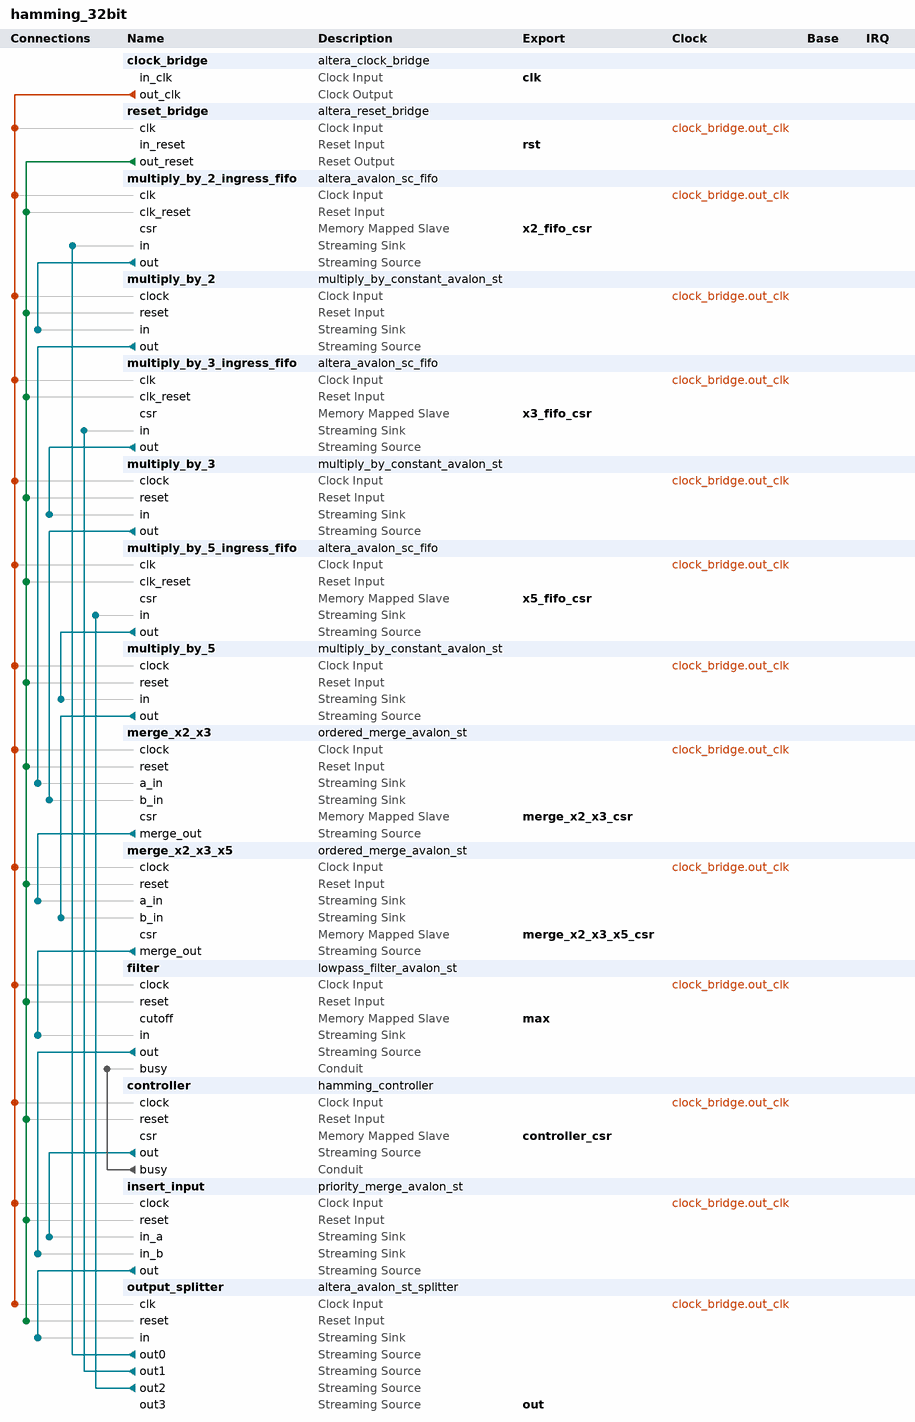
[diagram p0: system contents]
# Platform Designer (Qsys) system hamming_32bit, Cyclone V 5CSXFC6C6U23C8ES
# Parameters at their usual value, and those the tool derives, are not listed.
package require -exact qsys 13.1
create_system hamming_32bit
set_project_property DEVICE_FAMILY {Cyclone V}
set_project_property DEVICE 5CSXFC6C6U23C8ES

add_instance clock_bridge altera_clock_bridge 13.1
set_instance_parameter_value clock_bridge DERIVED_CLOCK_RATE 0
set_instance_parameter_value clock_bridge EXPLICIT_CLOCK_RATE 0

add_instance reset_bridge altera_reset_bridge 13.1
set_instance_parameter_value reset_bridge ACTIVE_LOW_RESET 0
set_instance_parameter_value reset_bridge SYNCHRONOUS_EDGES deassert

add_instance multiply_by_2_ingress_fifo altera_avalon_sc_fifo 13.1
set_instance_parameter_value multiply_by_2_ingress_fifo SYMBOLS_PER_BEAT 4
set_instance_parameter_value multiply_by_2_ingress_fifo BITS_PER_SYMBOL 8
set_instance_parameter_value multiply_by_2_ingress_fifo FIFO_DEPTH 256
set_instance_parameter_value multiply_by_2_ingress_fifo CHANNEL_WIDTH 0
set_instance_parameter_value multiply_by_2_ingress_fifo ERROR_WIDTH 0
set_instance_parameter_value multiply_by_2_ingress_fifo USE_PACKETS 1
set_instance_parameter_value multiply_by_2_ingress_fifo USE_FILL_LEVEL 1
set_instance_parameter_value multiply_by_2_ingress_fifo USE_MEMORY_BLOCKS 1
set_instance_parameter_value multiply_by_2_ingress_fifo USE_STORE_FORWARD 0

add_instance multiply_by_2 multiply_by_constant_avalon_st 1.0
set_instance_parameter_value multiply_by_2 IN_WIDTH 32
set_instance_parameter_value multiply_by_2 OUT_WIDTH 35
set_instance_parameter_value multiply_by_2 MULTIPLIER 2

add_instance multiply_by_3_ingress_fifo altera_avalon_sc_fifo 13.1
set_instance_parameter_value multiply_by_3_ingress_fifo SYMBOLS_PER_BEAT 4
set_instance_parameter_value multiply_by_3_ingress_fifo BITS_PER_SYMBOL 8
set_instance_parameter_value multiply_by_3_ingress_fifo FIFO_DEPTH 256
set_instance_parameter_value multiply_by_3_ingress_fifo CHANNEL_WIDTH 0
set_instance_parameter_value multiply_by_3_ingress_fifo ERROR_WIDTH 0
set_instance_parameter_value multiply_by_3_ingress_fifo USE_PACKETS 1
set_instance_parameter_value multiply_by_3_ingress_fifo USE_FILL_LEVEL 1
set_instance_parameter_value multiply_by_3_ingress_fifo USE_MEMORY_BLOCKS 1
set_instance_parameter_value multiply_by_3_ingress_fifo USE_STORE_FORWARD 0

add_instance multiply_by_3 multiply_by_constant_avalon_st 1.0
set_instance_parameter_value multiply_by_3 IN_WIDTH 32
set_instance_parameter_value multiply_by_3 OUT_WIDTH 35
set_instance_parameter_value multiply_by_3 MULTIPLIER 3

add_instance multiply_by_5_ingress_fifo altera_avalon_sc_fifo 13.1
set_instance_parameter_value multiply_by_5_ingress_fifo SYMBOLS_PER_BEAT 4
set_instance_parameter_value multiply_by_5_ingress_fifo BITS_PER_SYMBOL 8
set_instance_parameter_value multiply_by_5_ingress_fifo FIFO_DEPTH 512
set_instance_parameter_value multiply_by_5_ingress_fifo CHANNEL_WIDTH 0
set_instance_parameter_value multiply_by_5_ingress_fifo ERROR_WIDTH 0
set_instance_parameter_value multiply_by_5_ingress_fifo USE_PACKETS 1
set_instance_parameter_value multiply_by_5_ingress_fifo USE_FILL_LEVEL 1
set_instance_parameter_value multiply_by_5_ingress_fifo USE_MEMORY_BLOCKS 1
set_instance_parameter_value multiply_by_5_ingress_fifo USE_STORE_FORWARD 0

add_instance multiply_by_5 multiply_by_constant_avalon_st 1.0
set_instance_parameter_value multiply_by_5 IN_WIDTH 32
set_instance_parameter_value multiply_by_5 OUT_WIDTH 35
set_instance_parameter_value multiply_by_5 MULTIPLIER 5

add_instance merge_x2_x3 ordered_merge_avalon_st 1.0
set_instance_parameter_value merge_x2_x3 DATA_WIDTH 35
set_instance_parameter_value merge_x2_x3 CSR_WIDTH 32
set_instance_parameter_value merge_x2_x3 SEND_ENDOFPACKET 1
set_instance_parameter_value merge_x2_x3 END_PACKET_VALUE 0

add_instance merge_x2_x3_x5 ordered_merge_avalon_st 1.0
set_instance_parameter_value merge_x2_x3_x5 DATA_WIDTH 35
set_instance_parameter_value merge_x2_x3_x5 CSR_WIDTH 32
set_instance_parameter_value merge_x2_x3_x5 SEND_ENDOFPACKET 1
set_instance_parameter_value merge_x2_x3_x5 END_PACKET_VALUE 0

add_instance filter lowpass_filter_avalon_st 1.0
set_instance_parameter_value filter IN_WIDTH 35
set_instance_parameter_value filter OUT_WIDTH 32
set_instance_parameter_value filter DEFAULT_CUTOFF -1
set_instance_parameter_value filter FORWARD_DELIMITERS 0
set_instance_parameter_value filter EOP_ON_EXCEED 1
set_instance_parameter_value filter NEW_EOP_VALUE 0

add_instance controller hamming_controller 1.0
set_instance_parameter_value controller WIDTH 32

add_instance insert_input priority_merge_avalon_st 1.0
set_instance_parameter_value insert_input WIDTH 32

add_instance output_splitter altera_avalon_st_splitter 13.1
set_instance_parameter_value output_splitter NUMBER_OF_OUTPUTS 4
set_instance_parameter_value output_splitter QUALIFY_VALID_OUT 1
set_instance_parameter_value output_splitter USE_READY 1
set_instance_parameter_value output_splitter USE_VALID 1
set_instance_parameter_value output_splitter USE_PACKETS 1
set_instance_parameter_value output_splitter USE_CHANNEL 0
set_instance_parameter_value output_splitter USE_ERROR 0
set_instance_parameter_value output_splitter USE_DATA 1
set_instance_parameter_value output_splitter DATA_WIDTH 32
set_instance_parameter_value output_splitter CHANNEL_WIDTH 1
set_instance_parameter_value output_splitter ERROR_WIDTH 1
set_instance_parameter_value output_splitter BITS_PER_SYMBOL 8
set_instance_parameter_value output_splitter MAX_CHANNELS 1
set_instance_parameter_value output_splitter READY_LATENCY 0

# connections
add_connection clock_bridge.out_clk controller.clock clock
add_connection clock_bridge.out_clk filter.clock clock
add_connection clock_bridge.out_clk insert_input.clock clock
add_connection clock_bridge.out_clk merge_x2_x3.clock clock
add_connection clock_bridge.out_clk merge_x2_x3_x5.clock clock
add_connection clock_bridge.out_clk multiply_by_2.clock clock
add_connection clock_bridge.out_clk multiply_by_2_ingress_fifo.clk clock
add_connection clock_bridge.out_clk multiply_by_3.clock clock
add_connection clock_bridge.out_clk multiply_by_3_ingress_fifo.clk clock
add_connection clock_bridge.out_clk multiply_by_5.clock clock
add_connection clock_bridge.out_clk multiply_by_5_ingress_fifo.clk clock
add_connection clock_bridge.out_clk output_splitter.clk clock
add_connection clock_bridge.out_clk reset_bridge.clk clock
add_connection reset_bridge.out_reset controller.reset reset
add_connection reset_bridge.out_reset filter.reset reset
add_connection reset_bridge.out_reset insert_input.reset reset
add_connection reset_bridge.out_reset merge_x2_x3.reset reset
add_connection reset_bridge.out_reset merge_x2_x3_x5.reset reset
add_connection reset_bridge.out_reset multiply_by_2.reset reset
add_connection reset_bridge.out_reset multiply_by_2_ingress_fifo.clk_reset reset
add_connection reset_bridge.out_reset multiply_by_3.reset reset
add_connection reset_bridge.out_reset multiply_by_3_ingress_fifo.clk_reset reset
add_connection reset_bridge.out_reset multiply_by_5.reset reset
add_connection reset_bridge.out_reset multiply_by_5_ingress_fifo.clk_reset reset
add_connection reset_bridge.out_reset output_splitter.reset reset
add_connection controller.out insert_input.in_a avalon_streaming
add_connection filter.out insert_input.in_b avalon_streaming
add_connection insert_input.out output_splitter.in avalon_streaming
add_connection merge_x2_x3.merge_out merge_x2_x3_x5.a_in avalon_streaming
add_connection merge_x2_x3_x5.merge_out filter.in avalon_streaming
add_connection multiply_by_2.out merge_x2_x3.a_in avalon_streaming
add_connection multiply_by_2_ingress_fifo.out multiply_by_2.in avalon_streaming
add_connection multiply_by_3.out merge_x2_x3.b_in avalon_streaming
add_connection multiply_by_3_ingress_fifo.out multiply_by_3.in avalon_streaming
add_connection multiply_by_5.out merge_x2_x3_x5.b_in avalon_streaming
add_connection multiply_by_5_ingress_fifo.out multiply_by_5.in avalon_streaming
add_connection output_splitter.out0 multiply_by_2_ingress_fifo.in avalon_streaming
add_connection output_splitter.out1 multiply_by_3_ingress_fifo.in avalon_streaming
add_connection output_splitter.out2 multiply_by_5_ingress_fifo.in avalon_streaming
add_connection controller.busy filter.busy conduit

# exported interfaces
add_interface out avalon_streaming source
set_interface_property out EXPORT_OF output_splitter.out3
add_interface max avalon slave
set_interface_property max EXPORT_OF filter.cutoff
add_interface clk clock sink
set_interface_property clk EXPORT_OF clock_bridge.in_clk
add_interface rst reset sink
set_interface_property rst EXPORT_OF reset_bridge.in_reset
add_interface controller_csr avalon slave
set_interface_property controller_csr EXPORT_OF controller.csr
add_interface x5_fifo_csr avalon slave
set_interface_property x5_fifo_csr EXPORT_OF multiply_by_5_ingress_fifo.csr
add_interface x3_fifo_csr avalon slave
set_interface_property x3_fifo_csr EXPORT_OF multiply_by_3_ingress_fifo.csr
add_interface x2_fifo_csr avalon slave
set_interface_property x2_fifo_csr EXPORT_OF multiply_by_2_ingress_fifo.csr
add_interface merge_x2_x3_csr avalon slave
set_interface_property merge_x2_x3_csr EXPORT_OF merge_x2_x3.csr
add_interface merge_x2_x3_x5_csr avalon slave
set_interface_property merge_x2_x3_x5_csr EXPORT_OF merge_x2_x3_x5.csr

set_interconnect_requirement {$system} qsys_mm.clockCrossingAdapter HANDSHAKE
set_interconnect_requirement {$system} qsys_mm.maxAdditionalLatency 1
set_interconnect_requirement {$system} qsys_mm.insertDefaultSlave false

save_system hamming_32bit.qsys
